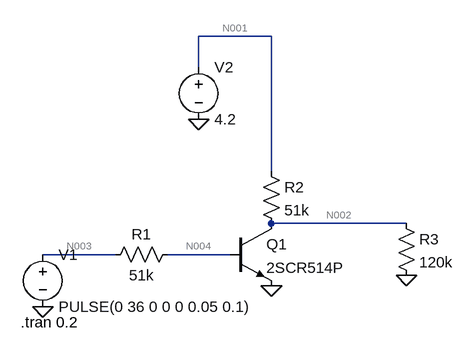
[diagram p0: schematic Draft1.asc]
Draft1.asc, the LTspice schematic file:
Version 4
SHEET 1 880 680
WIRE 192 -160 80 -160
WIRE 80 -112 80 -160
WIRE 192 48 192 -160
WIRE 400 128 192 128
WIRE -48 176 -160 176
WIRE 128 176 32 176
FLAG -160 256 0
FLAG 192 224 0
FLAG 80 -32 0
FLAG 400 208 0
SYMBOL npn 128 128 R0
SYMATTR InstName Q1
SYMATTR Value 2SCR514P
SYMBOL res 48 160 R90
WINDOW 0 0 56 VBottom 2
WINDOW 3 32 56 VTop 2
SYMATTR InstName R1
SYMATTR Value 51k
SYMBOL voltage -160 160 R0
WINDOW 123 0 0 Left 2
WINDOW 39 0 0 Left 2
SYMATTR InstName V1
SYMATTR Value PULSE(0 36 0 0 0 0.05 0.1)
SYMBOL voltage 80 -128 R0
WINDOW 123 0 0 Left 2
WINDOW 39 0 0 Left 2
SYMATTR InstName V2
SYMATTR Value 4.2
SYMBOL res 384 112 R0
SYMATTR InstName R3
SYMATTR Value 120k
SYMBOL res 176 32 R0
SYMATTR InstName R2
SYMATTR Value 51k
TEXT -194 280 Left 2 !.tran 0.2

The netlist it stands for:
* Draft1.asc
Q1 N002 N004 0 0 2SCR514P
R1 N004 N003 51k
V1 N003 0 PULSE(0 36 0 0 0 0.05 0.1)
V2 N001 0 4.2
R3 N002 0 120k
R2 N001 N002 51k
.model NPN NPN
.model PNP PNP
.lib standard.bjt
.tran 0.2
.backanno
.end

* Results of the author's LTspice run, read from the files saved beside the schematic
* Operating Point, zero values left out:
*   V(n002) = 2.947 V
*   V(n004) = 922.2 nV
*   V(n001) = 4.2 V
*   Ic(Q1) = 18.3 pA
*   Ib(Q1) = -18.08 pA
*   I(R2) = 24.56 µA
*   I(R3) = 24.56 µA
*   I(R1) = 18.08 pA
*   I(V2) = -24.56 µA
*   I(V1) = 18.08 pA
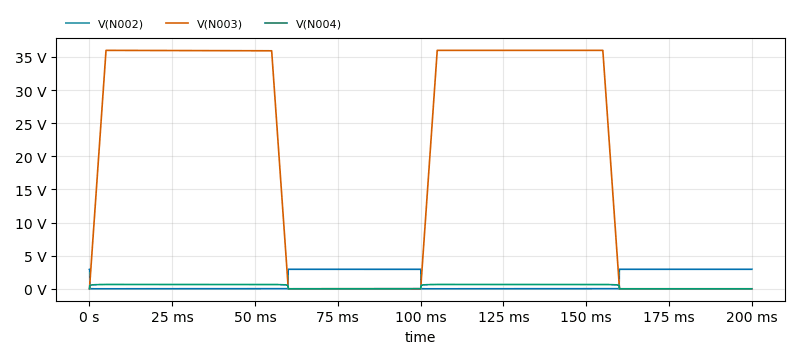
[diagram p1: Transient Analysis of Draft1.asc, plotted from the saved traces]
* Transient Analysis, 1 run:
*   V(N002): min 1.314 mV, max 2.95 V, average 1.184 V, rms 1.867 V, last 2.947 V
*   V(N003): min 0 V, max 36 V, average 19.79 V, rms 26.29 V, last 0 V
*   V(N004): min -4.274 µV, max 654.2 mV, average 388.5 mV, rms 502 mV, last 922.2 nV